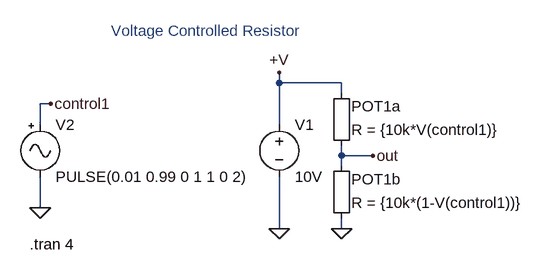
[diagram p0: schematic potentiometer demo4.asc]
potentiometer demo4.asc, the LTspice schematic file:
Version 4
SHEET 1 880 680
WIRE -416 192 -416 176
WIRE -320 192 -416 192
WIRE -320 208 -320 192
WIRE -768 224 -784 224
WIRE -784 256 -784 224
WIRE -416 256 -416 192
WIRE -320 304 -320 288
WIRE -272 304 -320 304
WIRE -320 320 -320 304
WIRE -784 384 -784 336
WIRE -416 416 -416 336
WIRE -320 416 -320 400
FLAG -416 416 0
FLAG -416 176 +V
FLAG -320 416 0
FLAG -272 304 out
FLAG -768 224 control1
FLAG -784 384 0
SYMBOL voltage -416 240 R0
WINDOW 123 0 0 Left 0
WINDOW 39 0 0 Left 0
SYMATTR InstName V1
SYMATTR Value 10V
SYMBOL Misc\\EuropeanResistor -336 416 M180
WINDOW 0 31 76 Left 2
WINDOW 3 31 40 Left 2
SYMATTR InstName POT1b
SYMATTR Value R = {10k*(1-V(control1))}
SYMBOL Misc\\EuropeanResistor -336 304 M180
WINDOW 0 31 76 Left 2
WINDOW 3 31 40 Left 2
SYMATTR InstName POT1a
SYMATTR Value R = {10k*V(control1)}
SYMBOL Misc\\signal -784 240 R0
WINDOW 123 0 0 Left 0
WINDOW 39 0 0 Left 0
SYMATTR InstName V2
SYMATTR Value PULSE(0.01 0.99 0 1 1 0 2)
TEXT -800 440 Left 2 !.tran 4
TEXT -528 112 Center 2 ;Voltage Controlled Resistor

The netlist it stands for:
* potentiometer demo4.asc
V1 +V 0 10V
R§POT1b 0 out R = {10k*(1-V(control1))}
R§POT1a out +V R = {10k*V(control1)}
V2 control1 0 PULSE(0.01 0.99 0 1 1 0 2)
.tran 4
* Voltage Controlled Resistor
.backanno
.end